# Altium schematic sheet display.SchDoc
size A3
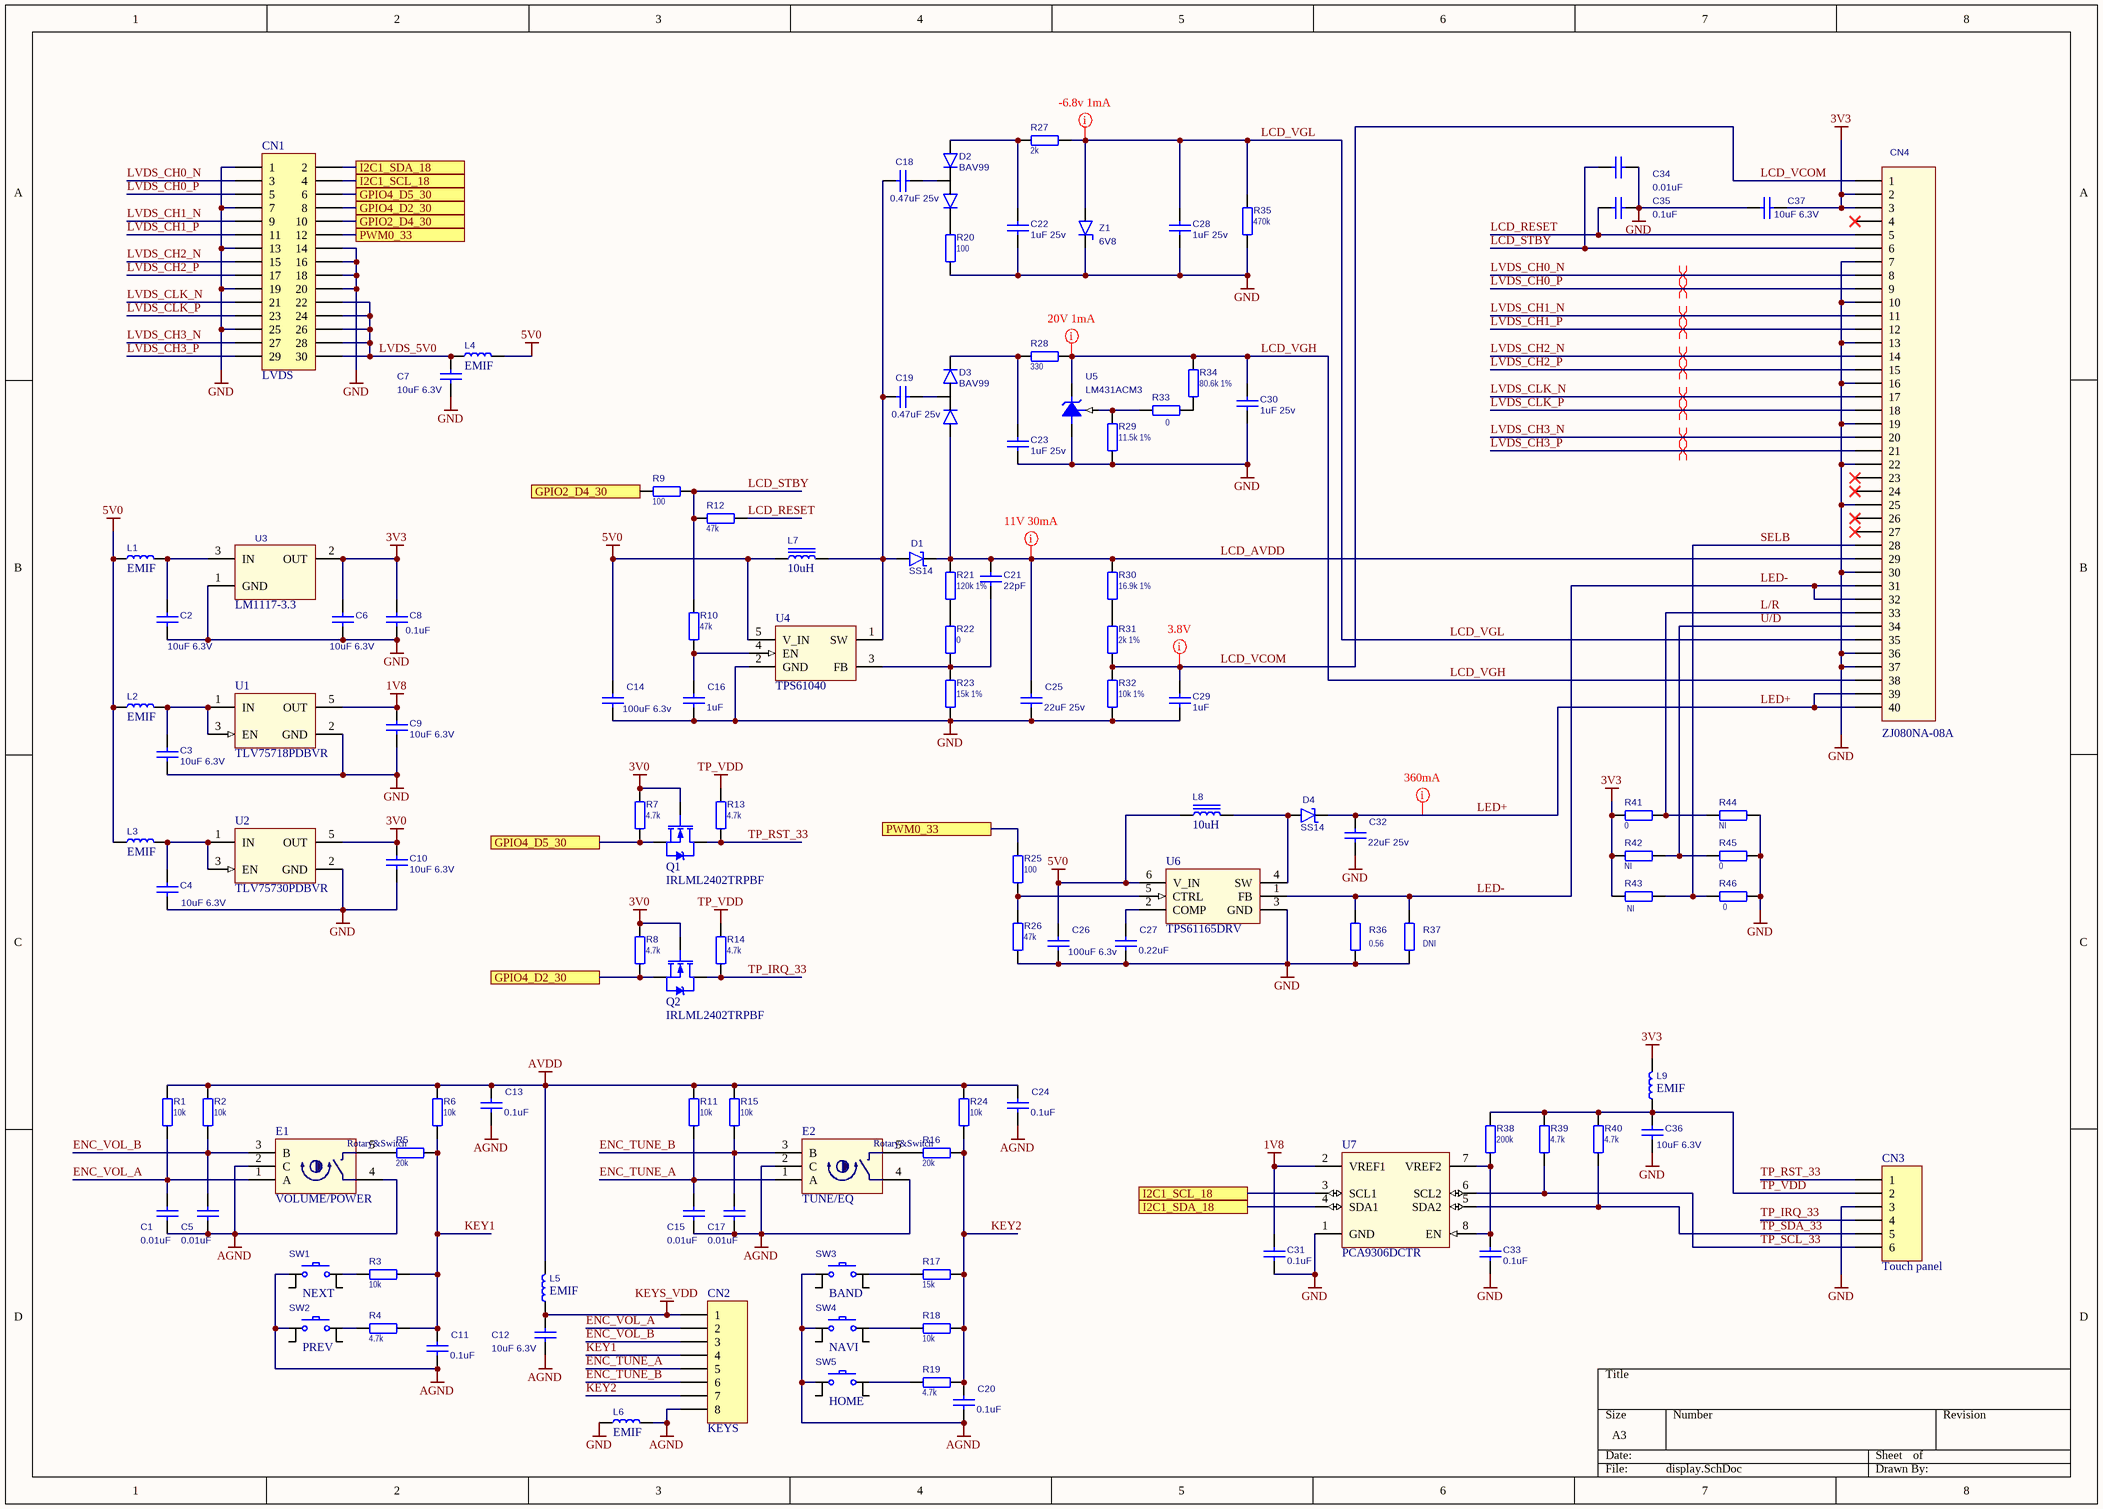
[diagram p0: display.SchDoc]

## Parts
C1  value 0.01uF  [C0603]  (hidden comment: CL10B103KB8NNNC)
C2  value 10uF 6.3V  [C0603]  (hidden comment: CC0603MRX5R5BB106)
C3  value 10uF 6.3V  [C0603]  (hidden comment: CC0603MRX5R5BB106)
C4  value 10uF 6.3V  [C0603]  (hidden comment: CC0603MRX5R5BB106)
C5  value 0.01uF  [C0603]  (hidden comment: CL10B103KB8NNNC)
C6  value 10uF 6.3V  [C0603]  (hidden comment: CC0603MRX5R5BB106)
C7  value 10uF 6.3V  [C0603]  (hidden comment: CC0603MRX5R5BB106)
C8  value 0.1uF  [C0603]  (hidden comment: C1608X7R1H104K080AA)
C9  value 10uF 6.3V  [C0603]  (hidden comment: CC0603MRX5R5BB106)
C10  value 10uF 6.3V  [C0603]  (hidden comment: CC0603MRX5R5BB106)
C11  value 0.1uF  [C0603]  (hidden comment: C1608X7R1H104K080AA)
C12  value 10uF 6.3V  [C0603]  (hidden comment: CC0603MRX5R5BB106)
C13  value 0.1uF  [C0603]  (hidden comment: C1608X7R1H104K080AA)
C14  value 100uF 6.3v  [C1206]  (hidden comment: CL31A107MQHNNNE)
C15  value 0.01uF  [C0603]  (hidden comment: CL10B103KB8NNNC)
C16  value 1uF  [C0603]  (hidden comment: GRM188R71E105KA12D)
C17  value 0.01uF  [C0603]  (hidden comment: CL10B103KB8NNNC)
C18  value 0.47uF 25v  [C0603]  (hidden comment: GRM188R71E474KA12D)
C19  value 0.47uF 25v  [C0603]  (hidden comment: GRM188R71E474KA12D)
C20  value 0.1uF  [C0603]  (hidden comment: C1608X7R1H104K080AA)
C21  value 22pF  [C0603]  (hidden comment: CL10C220JB8NNNC)
C22  value 1uF 25v  [C0805]  (hidden comment: GRM188R71E105KA12D)
C23  value 1uF 25v  [C0805]  (hidden comment: GRM188R71E105KA12D)
C24  value 0.1uF  [C0603]  (hidden comment: C1608X7R1H104K080AA)
C25  value 22uF 25v  [C0805]  (hidden comment: CL21A226MAQNNNE)
C26  value 100uF 6.3v  [C1206]  (hidden comment: CL31A107MQHNNNE)
C27  value 0.22uF  [C0603]  (hidden comment: CC0603ZRY5V8BB224)
C28  value 1uF 25v  [C0805]  (hidden comment: GRM188R71E105KA12D)
C29  value 1uF  [C0805]  (hidden comment: GRM188R71E105KA12D)
C30  value 1uF 25v  [C0805]  (hidden comment: GRM188R71E105KA12D)
C31  value 0.1uF  [C0603]  (hidden comment: C1608X7R1H104K080AA)
C32  value 22uF 25v  [C0805]  (hidden comment: CL21A226MAQNNNE)
C33  value 0.1uF  [C0603]  (hidden comment: C1608X7R1H104K080AA)
C34  value 0.01uF  [C0603]  (hidden comment: CL10B103KB8NNNC)
C35  value 0.1uF  [C0603]  (hidden comment: C1608X7R1H104K080AA)
C36  value 10uF 6.3V  [C0603]  (hidden comment: CC0603MRX5R5BB106)
C37  value 10uF 6.3V  [C0603]  (hidden comment: CC0603MRX5R5BB106)
CN1  LVDS  [DF13EA-30DP-1.25V]
CN2  KEYS  [1.25-8AW]
CN3  Touch panel  [6S-0.5SH]
CN4  value ZJ080NA-08A  [40S-0.5SH]  (hidden comment: FH12-40)
D1  SS14  [SMA]
D2  value BAV99  [SOT-23-3]  (hidden comment: BAV99.215)
D3  value BAV99  [SOT-23-3]  (hidden comment: BAV99.215)
D4  value SS14  [SMA]  (hidden comment: SS24)
E1  VOLUME/POWER  [Rotary Encoder]
E2  TUNE/EQ  [Rotary Encoder]
L1  value EMIF  [IND0805]  (hidden comment: BLM21PG221SN1D)
L2  value EMIF  [IND0603]  (hidden comment: BLM18AG102SN1D)
L3  value EMIF  [IND0603]  (hidden comment: BLM18AG102SN1D)
L4  value EMIF  [IND0805]  (hidden comment: BLM21PG221SN1D)
L5  value EMIF  [IND0603]  (hidden comment: BLM18AG102SN1D)
L6  value EMIF  [IND0603]  (hidden comment: BLM18AG102SN1D)
L7  value 10uH  [CDRH3D16]  (hidden comment: CDRH3D16NP-100NC)
L8  value 10uH  [CDRH6D28]  (hidden comment: CDRH6D28-100NC)
L9  value EMIF  [IND0603]  (hidden comment: BLM18AG102SN1D)
Q1  IRLML2402TRPBF  [SOT-23-3]
Q2  IRLML2402TRPBF  [SOT-23-3]
R1  10k  [R0603]
R2  10k  [R0603]
R3  10k  [R0603]
R4  4.7k  [R0603]
R5  20k  [R0603]
R6  10k  [R0603]
R7  4.7k  [R0603]
R8  4.7k  [R0603]
R9  100  [R0603]
R10  47k  [R0603]
R11  10k  [R0603]
R12  47k  [R0603]
R13  4.7k  [R0603]
R14  4.7k  [R0603]
R15  10k  [R0603]
R16  20k  [R0603]
R17  15k  [R0603]
R18  10k  [R0603]
R19  4.7k  [R0603]
R20  100  [R0603]
R21  value 120k 1%  [R0603]  (hidden comment: 120k)
R22  0  [R0603]
R23  value 15k 1%  [R0603]  (hidden comment: 15k)
R24  10k  [R0603]
R25  100  [R0603]
R26  47k  [R0603]
R27  2k  [R0603]
R28  330  [R0805]
R29  value 11.5k 1%  [R0603]  (hidden comment: 11.5k)
R30  value 16.9k 1%  [R0805]  (hidden comment: 16.9k)
R31  value 2k 1%  [R0603]  (hidden comment: 2k)
R32  value 10k 1%  [R0603]  (hidden comment: 10k)
R33  0  [R0603]
R34  value 80.6k 1%  [R0603]  (hidden comment: 80.6k)
R35  470k  [R0603]
R36  0.56  [R0805]
R37  DNI  [R0805]
R38  200k  [R0603]
R39  4.7k  [R0603]
R40  4.7k  [R0603]
R41  0  [R0603]
R42  value NI  [R0603]  (hidden comment: DNI)
R43  value NI  [R0603]  (hidden comment: DNI)
R44  value NI  [R0603]  (hidden comment: DNI)
R45  0  [R0603]
R46  0  [R0603]
SW1  NEXT  [12X12-SMT]
SW2  PREV  [12X12-SMT]
SW3  BAND  [12X12-SMT]
SW4  NAVI  [12X12-SMT]
SW5  HOME  [12X12-SMT]
U1  TLV75718PDBVR  [SOT-23-5]
U2  TLV75730PDBVR  [SOT-23-5]
U3  value LM1117-3.3  [SOT-223]  (hidden comment: LM1117)
U4  TPS61040  [SOT-23-5]
U5  LM431ACM3  [SOT-23-3]
U6  value TPS61165DRV  [SOT-23-6]  (hidden comment: TPS61165)
U7  PCA9306DCTR  [PSOP-8]
Z1  value 6V8  [SOD-80C]  (hidden comment: BZV55-C6V8)

## Ports
GPIO2_D4_30, GPIO4_D2_30, GPIO4_D5_30, I2C1_SCL_18, I2C1_SDA_18, PWM0_33

## Nets
1V8: C9.1 C31.1 U1.5(OUT) U7.2(VREF1)
3V0: C10.1 Q1.1(G) Q2.1(G) R7.2 R8.2 U2.5(OUT)
3V3: C6.1 C8.2 C37.2 CN4.2 CN4.3 L9.2 R41.1 R42.1 R43.1 U3.2(OUT)
5V0: C14.2 C26.2 L1.1 L2.1 L3.1 L4.1 L7.1 L8.1 U4.5(V_IN) U6.6(V_IN)
AGND: C1.1 C5.1 C11.2 C12.2 C13.2 C15.1 C17.1 C20.2 C24.2 CN2.8 E1.2(C) E1.4(SW) E2.2(C) E2.4(SW) L6.1 SW1.1 SW2.1 SW3.1 SW4.1 SW5.1
AVDD: C13.1 C24.1 L5.1 R1.2 R2.1 R6.2 R11.2 R15.1 R24.2
GND: C2.2 C3.2 C4.2 C6.2 C7.2 C8.1 C9.2 C10.2 C14.1 C16.1 C22.1 C23.1 C25.1 C26.1 C27.1 C28.1 C29.1 C30.1 C31.2 C32.1 C33.1 C34.1 C35.1 C36.2 C37.1 CN1.1 CN1.7 CN1.13 CN1.14 CN1.16 CN1.18 CN1.19 CN1.20 CN1.25 CN3.3 CN4.7 CN4.10 CN4.13 CN4.16 CN4.19 CN4.22 CN4.25 CN4.30 CN4.36 CN4.37 L6.2 R20.2 R23.1 R26.1 R29.1 R32.1 R35.1 R36.1 R37.1 R44.2 R45.2 R46.2 U1.2(GND) U2.2(GND) U3.1(GND) U4.2(GND) U5.3(A) U6.3(GND) U7.1(GND) Z1.2(K)
KEYS_VDD: C12.1 CN2.1 L5.2
TP_VDD: C36.1 CN3.2 L9.1 R13.2 R14.2 R38.1 R39.1 R40.1
ENC_TUNE_A: C15.2 CN2.5 E2.1(A) R11.1
ENC_TUNE_B: C17.2 CN2.6 E2.3(B) R15.2
ENC_VOL_A: C1.2 CN2.2 E1.1(A) R1.1
ENC_VOL_B: C5.2 CN2.3 E1.3(B) R2.2
GPIO2_D4_30: CN1.10 R9.2 ; port GPIO2_D4_30
GPIO4_D2_30: CN1.8 Q2.2(S) R8.1 ; port GPIO4_D2_30
GPIO4_D5_30: CN1.6 Q1.2(S) R7.1 ; port GPIO4_D5_30
I2C1_SCL_18: CN1.4 U7.3(SCL1) ; port I2C1_SCL_18
I2C1_SDA_18: CN1.2 U7.4(SDA1) ; port I2C1_SDA_18
KEY1: C11.1 CN2.4 R3.2 R4.2 R5.1 R6.1
KEY2: C20.1 CN2.7 R16.1 R17.2 R18.2 R19.2 R24.1
L/R: CN4.33 R41.2 R44.1
LCD_AVDD: C21.1 C25.2 CN4.29 D1.2(K) D3.1(A) R21.2 R30.2
LCD_RESET: C35.2 CN4.5 R12.1
LCD_STBY: C34.2 CN4.6 R9.1 R10.2 R12.2
LCD_VCOM: C29.2 CN4.1 R31.1 R32.2
LCD_VGH: C30.2 CN4.38 R28.2 R34.2 U5.1(K)
LCD_VGL: C28.2 CN4.35 R27.2 R35.2 Z1.1(A)
LED+: C32.2 CN4.39 CN4.40 D4.2(K)
LED-: CN4.31 CN4.32 R36.2 R37.2 U6.1(FB)
LVDS_5V0: C7.1 CN1.22 CN1.24 CN1.26 CN1.28 CN1.30 L4.2
LVDS_CH0_N: CN1.3 CN4.8
LVDS_CH0_P: CN1.5 CN4.9
LVDS_CH1_N: CN1.9 CN4.11
LVDS_CH1_P: CN1.11 CN4.12
LVDS_CH2_N: CN1.15 CN4.14
LVDS_CH2_P: CN1.17 CN4.15
LVDS_CH3_N: CN1.27 CN4.20
LVDS_CH3_P: CN1.29 CN4.21
LVDS_CLK_N: CN1.21 CN4.17
LVDS_CLK_P: CN1.23 CN4.18
PWM0_33: CN1.12 R25.2 ; port PWM0_33
SELB: CN4.28 R43.2 R46.1
TP_IRQ_33: CN3.4 Q2.3(D) R14.1
TP_RST_33: CN3.1 Q1.3(D) R13.1
TP_SCL_33: CN3.6 R39.2 U7.6(SCL2)
TP_SDA_33: CN3.5 R40.2 U7.5(SDA2)
U/D: CN4.34 R42.2 R45.1
NetC2_1: C2.1 L1.2 U3.3(IN)
NetC3_1: C3.1 L2.2 U1.1(IN) U1.3(EN)
NetC4_1: C4.1 L3.2 U2.1(IN) U2.3(EN)
NetC16_2: C16.2 R10.1 U4.4(EN)
NetC18_1: C18.1 D2.3(A+K)
NetC18_2: C18.2 C19.2 D1.1(A) L7.2 U4.1(SW)
NetC19_1: C19.1 D3.3(A+K)
NetC21_2: C21.2 R22.1 R23.2 U4.3(FB)
NetC22_2: C22.2 D2.1(A) R27.1
NetC23_2: C23.2 D3.2(K) R28.1
NetC27_2: C27.2 U6.2(COMP)
NetC33_2: C33.2 R38.2 U7.7(VREF2) U7.8(EN)
NetD2_2: D2.2(K) R20.1
NetD4_1: D4.1(A) L8.2 U6.4(SW)
NetE1_5: E1.5(SW) R5.2
NetE2_5: E2.5(SW) R16.2
NetR3_1: R3.1 SW1.3
NetR4_1: R4.1 SW2.3
NetR17_1: R17.1 SW3.3
NetR18_1: R18.1 SW4.3
NetR19_1: R19.1 SW5.3
NetR21_1: R21.1 R22.2
NetR25_1: R25.1 R26.2 U6.5(CTRL)
NetR29_2: R29.2 R33.2 U5.2(REF)
NetR30_1: R30.1 R31.2
NetR33_1: R33.1 R34.1

Not connected (* = marked no-connect by the designer): CN4 4* 23* 24* 26* 27*; SW1 2 4; SW2 2 4; SW3 2 4; SW4 2 4; SW5 2 4

## Layout directives
mark named 360mA: LED+
mark named 11V 30mA: LCD_AVDD
mark named -6.8v 1mA: LCD_VGL
mark named 20V 1mA: LCD_VGH
mark named 3.8V: LCD_VCOM
differential pair: LVDS_CH0_N, LVDS_CH0_P, LVDS_CH1_N, LVDS_CH1_P, LVDS_CH2_N, LVDS_CH2_P, LVDS_CH3_N, LVDS_CH3_P, LVDS_CLK_N, LVDS_CLK_P

## Notes on the sheet
- (in symbol ENC_SW) Rotary&Switch

## Library data of the parts
C1-C37 = CAP_NPOL
CN1 = HDR 15X2: Header, 15-Pin, Dual row; LatestRevisionDate: 17-Jul-2002; LatestRevisionNote: Re-released for DXP Platform.; Publisher: Altium Limited
CN2 = HDR 8: Header, 8-Pin; LatestRevisionDate: 17-Jul-2002; LatestRevisionNote: Re-released for DXP Platform.; Publisher: Altium Limited
CN3 = Header 6: Header, 6-Pin; LatestRevisionDate: 17-Jul-2002; LatestRevisionNote: Re-released for DXP Platform.; Publisher: Altium Limited
CN4 = FH12-40: DT38
D1 D4 = SHOTTKY
  D1: Value: SS14
D2 D3 = DIODE_DUAL_1: Dual series 1
E1 E2 = ENC_SW
L1-L6 L9 = IND_WO_IRON
L7 L8 = IND_W_IRON
Q1 Q2 = N-Channel: HEXFET Power MOSFET; Value: IRLML2402
R1-R8 R10-R24 R26-R46 = RESISTOR: RES
  R1-R3 R6 R11 R15 R18 R24: Value: 10k
  R4 R7 R8 R13 R14 R19 R39 R40: Value: 4.7k
  R5 R16: Value: 20k
  R10 R12 R26: Value: 47k
  R17: Value: 15k
  R20: Value: 100
  R22 R33 R41 R45 R46: Value: 0
  R27: Value: 2k
  R28: Value: 330
  R35: Value: 470k
  R36: Value: 0.56
  R37: Value: DNI
  R38: Value: 200k
R9 R25 = RESISTOR: Value: 100
SW1-SW5 = SW-TACT-4PIN: Value: SW-TACT-4PIN
U1 U2 = TLV733P: Capacitor-Free, 300-mA, Low-Dropout Regulator with Foldback Current Limit for Portable Devices; value: TLV733P
U4 = TPS6104x
U5 = LM431ACM3: Adjustable Precision Zener Shunt Regulator, 3-pin SOT-23; Manufacturer: National Semiconductor; PackageTopMarking: N1F*XTT; PowerWise: N; CompType: MiscPower; Published: 4-Dec-2008; DatasheetVersion: Mar-2005; PackageVersion: revB, Mar-2003; PackageReference: MF03A; Publisher: Altium Limited; PackageDescription: Molded SOT-23, .115 x .051 x .037in Body, 3 Lead, .075 in Pitch; Supplier 1: Farnell; Supplier Part Number 1: 1215209; PartNumber: LM431ACM3; RoHS: N; PinCount: 3; ComponentLink1Description: LM431 Datasheet; ComponentLink1URL: http://www.national.com/ds/LM/LM431.pdf; ComponentLink2Description: LM431 Web Page; ComponentLink2URL: http://www.national.com/pf/LM/LM431.html; ComponentLink3Description: MF03A Package Page; ComponentLink3URL: http://www.national.com/packaging/folders/mf03a.html
U6 = TPS61165DRV: TPS61165DRV (WSON6 package)
U7 = PCA9306: PCA9306 Dual Bidirectional I2C Bus and SMBus Voltage-Level Translator; value: PCA9306DCTR
Z1 = ZENNER